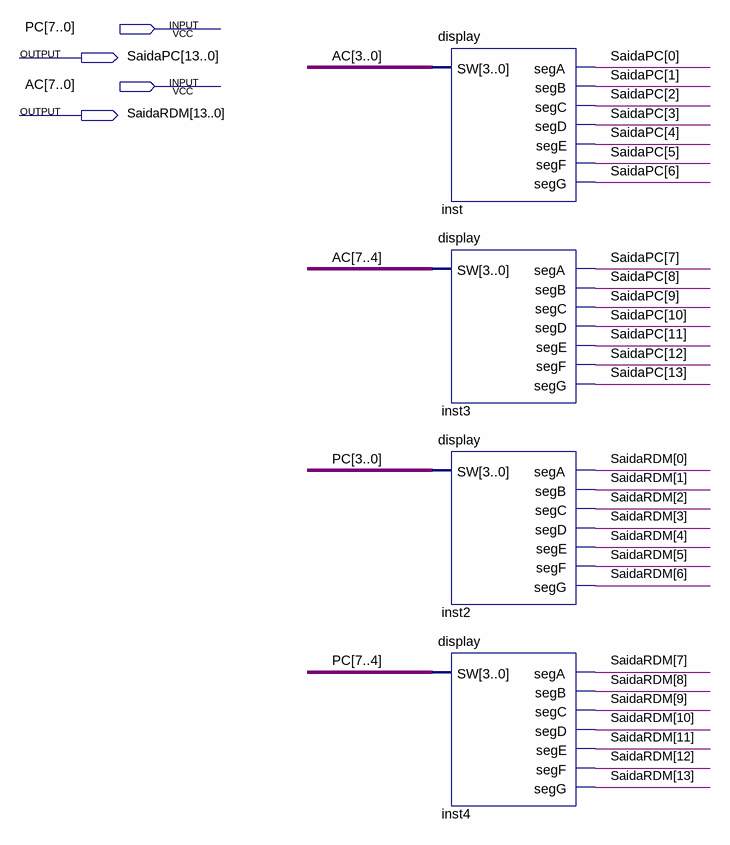
[diagram p0: schematic sheet]
// Quartus schematic allDisplays.bdf as structural Verilog: 4 symbols, 4 pins
module allDisplays (
  input  [7:0] PC,
  input  [7:0] AC,
  output [13:0] SaidaPC,
  output [13:0] SaidaRDM
);

  display inst (
    .SW(AC[3:0]), .segA(SaidaPC[0]), .segB(SaidaPC[1]), .segC(SaidaPC[2]), .segD(SaidaPC[3]),
    .segE(SaidaPC[4]), .segF(SaidaPC[5]), .segG(SaidaPC[6]));
  display inst3 (
    .SW(AC[7:4]), .segA(SaidaPC[7]), .segB(SaidaPC[8]), .segC(SaidaPC[9]), .segD(SaidaPC[10]),
    .segE(SaidaPC[11]), .segF(SaidaPC[12]), .segG(SaidaPC[13]));
  display inst2 (
    .SW(PC[3:0]), .segA(SaidaRDM[0]), .segB(SaidaRDM[1]), .segC(SaidaRDM[2]), .segD(SaidaRDM[3]),
    .segE(SaidaRDM[4]), .segF(SaidaRDM[5]), .segG(SaidaRDM[6]));
  display inst4 (
    .SW(PC[7:4]), .segA(SaidaRDM[7]), .segB(SaidaRDM[8]), .segC(SaidaRDM[9]), .segD(SaidaRDM[10]),
    .segE(SaidaRDM[11]), .segF(SaidaRDM[12]), .segG(SaidaRDM[13]));
endmodule
